# Altium schematic sheet mmc_sd.SchDoc
size A4; Engineer: Amir Hossein Jobeiri; Organization: Simaran; SheetNumber: 18; SheetTotal: 23
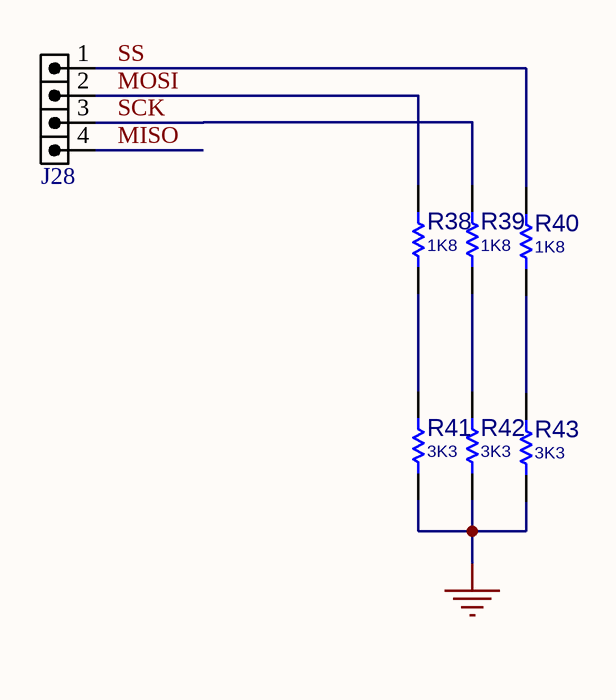
[diagram p0: mmc_sd.SchDoc]

## Parts
J28  HDR1X4  [HDRMINI_M_1X4]  (value not drawn)
R38  1K8  [R025W_AX04]
R39  1K8  [R025W_AX04]
R40  1K8  [R025W_AX04]
R41  3K3  [R025W_AX04]
R42  3K3  [R025W_AX04]
R43  3K3  [R025W_AX04]

## Nets
GND: R41.1 R42.1 R43.1
MISO: J28.4
MOSI: J28.2 R38.2
SCK: J28.3 R39.2
SS: J28.1 R40.2
NetR38_1: R38.1 R41.2
NetR39_1: R39.1 R42.2
NetR40_1: R40.1 R43.2

## Library data of the parts
J28 = HDRMINI_M_1X4: CONN, HEADER, Male, pitch: 1.27mm, 4POS; VALUE: HDRMINI_4
R38-R43 = RES_THD: RESISTOR, THD; MANF_P#: RK73H1ETTP4701F; MANF: KOA SPEER; PARAM: 0.063W; DESC: DESCRIPTION; DIST#: MOUSER; PARAM2: 1%; ASSEMBLY: ASSEMBLY; PRICE: 100= 0.5$
  R38-R40: VALUE: 1K8
  R41-R43: VALUE: 3K3